# Altium schematic sheet PIC32.SchDoc
size A; SheetNumber: 13; SheetTotal: 13
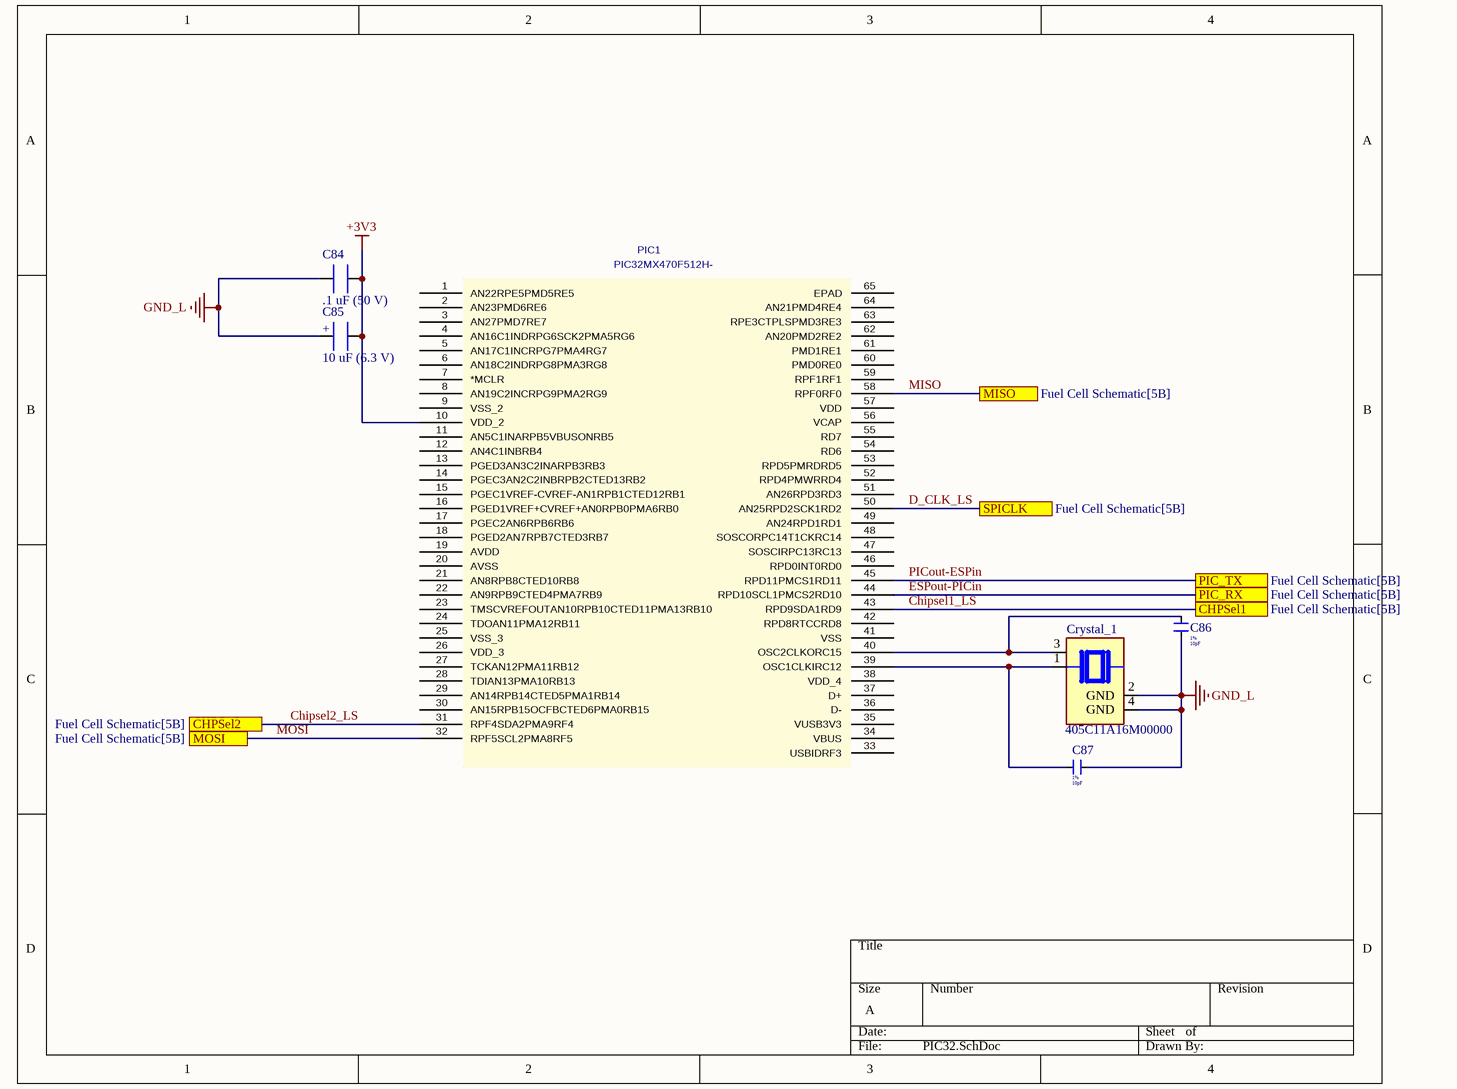
[diagram p0: PIC32.SchDoc]

## Parts
C84  .1 uF (50 V)  [.1uF capacitor]
C85  10 uF (6.3 V)  [10 uF cap]
C86  Tollerance: 1%  Capacitance: 10pF  [Kemet_10pF_0805]
C87  Tollerance: 1%  Capacitance: 10pF  [Kemet_10pF_0805]
Crystal_1  405C11A16M00000  [XTAL_405C11A16M00000]
PIC1  PIC32MX470F512H-  [Quad64]

## Ports
CHPSel1 (see Fuel Cell Schematic[5B]), CHPSel2 (see Fuel Cell Schematic[5B]), MISO (see Fuel Cell Schematic[5B]), MOSI (see Fuel Cell Schematic[5B]), PIC_RX (see Fuel Cell Schematic[5B]), PIC_TX (see Fuel Cell Schematic[5B]), SPICLK (see Fuel Cell Schematic[5B])

## Nets
+3V3: C84.2 C85.2 PIC1.10(VDD_2)
GND_L: C84.1 C85.1 C86.2 C87.1 Crystal_1.2(GND) Crystal_1.4(GND)
Chipsel1_LS: PIC1.43(RPD9SDA1RD9) ; port CHPSel1
Chipsel2_LS: PIC1.31(RPF4SDA2PMA9RF4) ; port CHPSel2
D_CLK_LS: PIC1.50(AN25RPD2SCK1RD2) ; port SPICLK
ESPout-PICin: PIC1.44(RPD10SCL1PMCS2RD10) ; port PIC_RX
MISO: PIC1.58(RPF0RF0) ; port MISO
MOSI: PIC1.32(RPF5SCL2PMA8RF5) ; port MOSI
PICout-ESPin: PIC1.45(RPD11PMCS1RD11) ; port PIC_TX
NetC86_1: C86.1 Crystal_1.3 PIC1.40(OSC2CLKORC15)
NetC87_2: C87.2 Crystal_1.1 PIC1.39(OSC1CLKIRC12)

Not connected (* = marked no-connect by the designer): PIC1 1(AN22RPE5PMD5RE5) 2(AN23PMD6RE6) 3(AN27PMD7RE7) 4(AN16C1INDRPG6SCK2PMA5RG6) 5(AN17C1INCRPG7PMA4RG7) 6(AN18C2INDRPG8PMA3RG8) 7(*MCLR) 8(AN19C2INCRPG9PMA2RG9) 9(VSS_2) 11(AN5C1INARPB5VBUSONRB5) 12(AN4C1INBRB4) 13(PGED3AN3C2INARPB3RB3) 14(PGEC3AN2C2INBRPB2CTED13RB2) 15(PGEC1VREF-CVREF-AN1RPB1CTED12RB1) 16(PGED1VREF+CVREF+AN0RPB0PMA6RB0) 17(PGEC2AN6RPB6RB6) 18(PGED2AN7RPB7CTED3RB7) 19(AVDD) 20(AVSS) 21(AN8RPB8CTED10RB8) 22(AN9RPB9CTED4PMA7RB9) 23(TMSCVREFOUTAN10RPB10CTED11PMA13RB10) 24(TDOAN11PMA12RB11) 25(VSS_3) 26(VDD_3) 27(TCKAN12PMA11RB12) 28(TDIAN13PMA10RB13) 29(AN14RPB14CTED5PMA1RB14) 30(AN15RPB15OCFBCTED6PMA0RB15) 33(USBIDRF3) 34(VBUS) 35(VUSB3V3) 36(D-) 37(D+) 38(VDD_4) 41(VSS) 42(RPD8RTCCRD8) 46(RPD0INT0RD0) 47(SOSCIRPC13RC13) 48(SOSCORPC14T1CKRC14) 49(AN24RPD1RD1) 51(AN26RPD3RD3) 52(RPD4PMWRRD4) 53(RPD5PMRDRD5) 54(RD6) 55(RD7) 56(VCAP) 57(VDD) 59(RPF1RF1) 60(PMD0RE0) 61(PMD1RE1) 62(AN20PMD2RE2) 63(RPE3CTPLSPMD3RE3) 64(AN21PMD4RE4) 65(EPAD)

## Notes on the sheet
- (in symbol 10 uF cap) +

## Library data of the parts
C84 = .1 uF cap
C85 = 10 uF cap
C86 C87 = C0805C100F5GACAUTO: Cap, AEC-Q200, 10PF, 50V, Mlcc, 0805;; Manufacturer: KEMET; Supplier 1: Digi-Key; RoHS: Yes; Category: Ceramic Capacitors; Stock 1: 3879; Pricing 1: 1=0.74000, 10=0.54800, 50=0.43840, 100=0.37570, 500=0.29744, 1000=0.25048 (USD); RoHS Compliant: Yes; Supplier Part Number 1: 399-C0805C100F5GACAUTOCT-ND; Manufacturer Part Number: C0805C100F5GACAUTO
Crystal_1 = 405C11A16M00000: CRYSTAL 16.0000MHZ 10PF SMD; MF: CTS-Frequency Controls; Digi-Key_Part_Number: CTX834TR-ND; Check_prices: https://www.snapeda.com/parts/405C11A16M00000/CTS-Frequency+Controls/view-part/?ref=eda; Purchase-URL: https://pricing.snapeda.com/search/part/405C11A16M00000/?ref=eda; Package: NON STANDARD-4 CTS Components; MP: 405C11A16M00000; Value: *; SnapEDA_Link: https://www.snapeda.com/parts/405C11A16M00000/CTS-Frequency+Controls/view-part/?ref=snap
PIC1 = PIC32MX470F512H-: Mfr_Name: Microchip; Manufacturer_Part_Number: PIC32MX470F512H-I/MR; C: Copyright (C) 2018 Accelerated Designs. All rights reserved; Value: PIC32MX470F512H-; Copyright: Copyright (C) 2023 Ultra Librarian. All rights reserved.